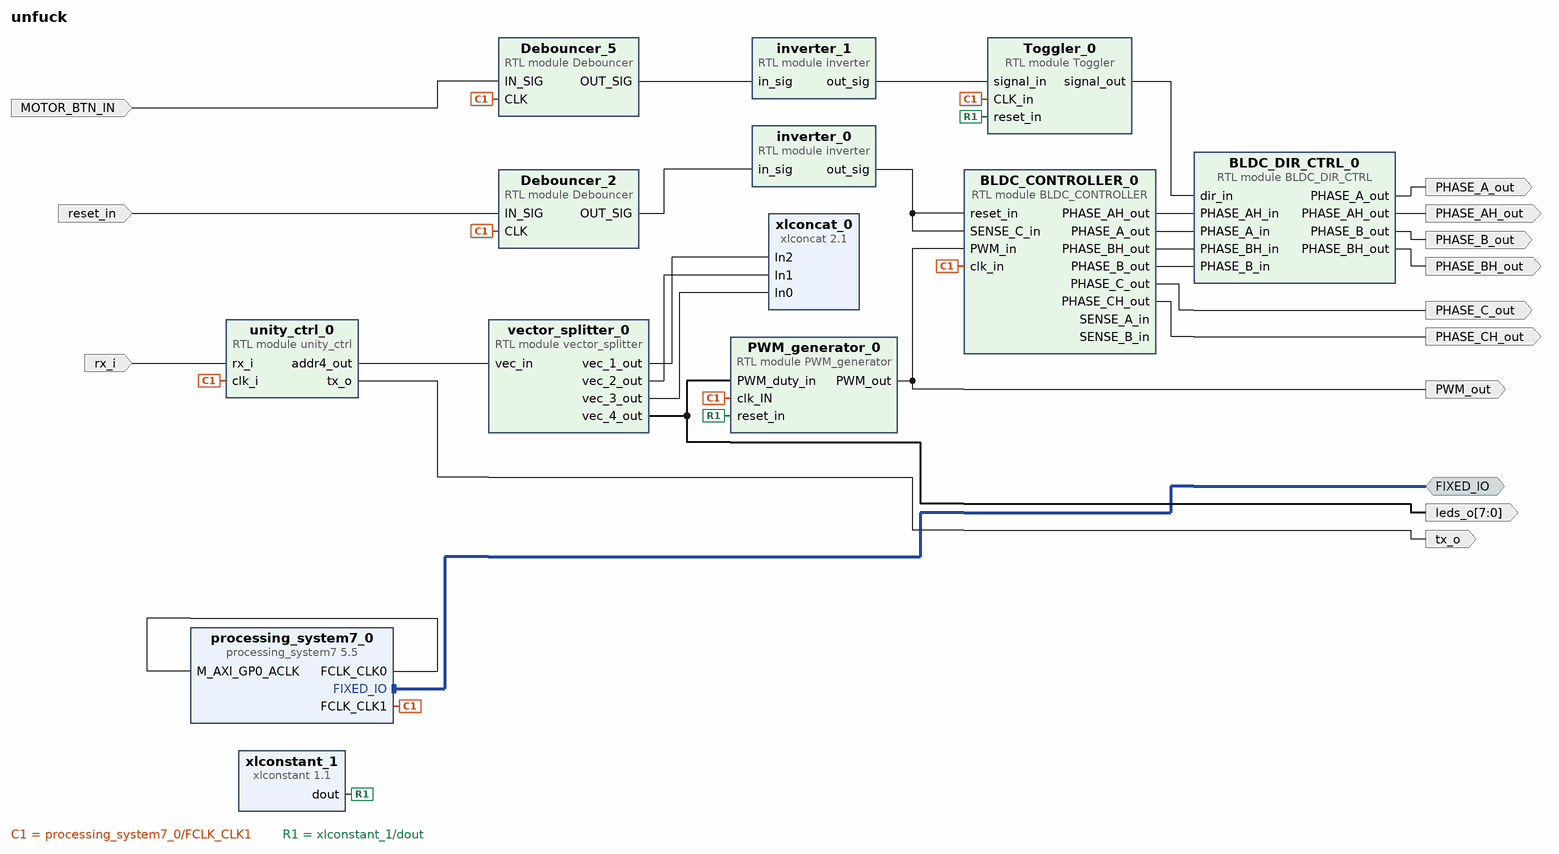
[diagram p0: block diagram of the top level]
# Vivado block design unfuck, xc7z010clg225-1, Vivado 2016.3
create_bd_design unfuck

create_bd_intf_port -mode Master -vlnv xilinx.com:display_processing_system7:fixedio_rtl:1.0 FIXED_IO
create_bd_port -dir O PHASE_CH_out
create_bd_port -dir O PHASE_C_out
create_bd_port -dir O PHASE_AH_out
create_bd_port -dir O PHASE_A_out
create_bd_port -dir O PHASE_BH_out
create_bd_port -dir O PHASE_B_out
create_bd_port -dir I MOTOR_BTN_IN
create_bd_port -dir O PWM_out
create_bd_port -dir I -type rst reset_in
set_property -dict {CONFIG.POLARITY ACTIVE_LOW} [get_bd_ports reset_in]
create_bd_port -dir I rx_i
create_bd_port -dir O -from 7 -to 0 leds_o
create_bd_port -dir O tx_o

create_bd_cell -type module -reference Debouncer Debouncer_2
set_property -dict {CONFIG.THRESHOLD 100000} [get_bd_cells Debouncer_2]
create_bd_cell -type module -reference PWM_generator PWM_generator_0
create_bd_cell -type module -reference Toggler Toggler_0
create_bd_cell -type module -reference inverter inverter_0
create_bd_cell -type ip -vlnv xilinx.com:ip:processing_system7:5.5 processing_system7_0
set_property -dict [list \
  CONFIG.PCW_FCLK_CLK1_BUF TRUE \
  CONFIG.PCW_APU_PERIPHERAL_FREQMHZ 666.666666 \
  CONFIG.PCW_FPGA0_PERIPHERAL_FREQMHZ 50 \
  CONFIG.PCW_FPGA1_PERIPHERAL_FREQMHZ 200 \
  CONFIG.PCW_M_AXI_GP0_FREQMHZ 50 \
  CONFIG.PCW_NUM_F2P_INTR_INPUTS 1 \
  CONFIG.PCW_DQ_WIDTH 16 \
  CONFIG.PCW_DQS_WIDTH 2 \
  CONFIG.PCW_DM_WIDTH 2 \
  CONFIG.PCW_MIO_PRIMITIVE 32 \
  CONFIG.PCW_EN_CLK1_PORT 1 \
  CONFIG.PCW_PERIPHERAL_BOARD_PRESET part0 \
  CONFIG.PCW_PRESET_BANK1_VOLTAGE {LVCMOS 3.3V} \
  CONFIG.PCW_UIPARAM_DDR_ENABLE 0 \
  CONFIG.PCW_QSPI_PERIPHERAL_ENABLE 1 \
  CONFIG.PCW_QSPI_QSPI_IO {MIO 1 .. 6} \
  CONFIG.PCW_QSPI_GRP_SINGLE_SS_ENABLE 1 \
  CONFIG.PCW_QSPI_GRP_SINGLE_SS_IO {MIO 1 .. 6} \
  CONFIG.PCW_ENET0_PERIPHERAL_ENABLE 0 \
  CONFIG.PCW_SD0_PERIPHERAL_ENABLE 0 \
  CONFIG.PCW_UART1_PERIPHERAL_ENABLE 0 \
  CONFIG.PCW_USB0_PERIPHERAL_ENABLE 0 \
  CONFIG.PCW_USB_RESET_ENABLE 1 \
  CONFIG.PCW_I2C_RESET_ENABLE 1 \
  CONFIG.PCW_GPIO_MIO_GPIO_ENABLE 1 \
  CONFIG.PCW_GPIO_MIO_GPIO_IO MIO \
  CONFIG.PCW_APU_CLK_RATIO_ENABLE 0.251400462962963 \
  CONFIG.PCW_ENET0_PERIPHERAL_CLKSRC External \
  CONFIG.PCW_UIPARAM_GENERATE_SUMMARY NONE \
  CONFIG.PCW_FPGA_FCLK1_ENABLE 1 \
] [get_bd_cells processing_system7_0]
# 386 more settings of processing_system7_0 are not shown: defaults, MIO pin electricals, DDR timing, and values the tool derives
create_bd_cell -type ip -vlnv xilinx.com:ip:xlconcat:2.1 xlconcat_0
set_property -dict {CONFIG.NUM_PORTS 3 CONFIG.IN0_WIDTH 8 CONFIG.IN1_WIDTH 8 CONFIG.IN2_WIDTH 8} [get_bd_cells xlconcat_0]
create_bd_cell -type ip -vlnv xilinx.com:ip:xlconstant:1.1 xlconstant_1
set_property -dict {CONFIG.CONST_VAL 0} [get_bd_cells xlconstant_1]
create_bd_cell -type module -reference BLDC_CONTROLLER BLDC_CONTROLLER_0
create_bd_cell -type module -reference BLDC_DIR_CTRL BLDC_DIR_CTRL_0
create_bd_cell -type module -reference unity_ctrl unity_ctrl_0
create_bd_cell -type module -reference vector_splitter vector_splitter_0
create_bd_cell -type module -reference Debouncer Debouncer_5
set_property -dict {CONFIG.THRESHOLD 100000} [get_bd_cells Debouncer_5]
create_bd_cell -type module -reference inverter inverter_1

# ---- connections ----

connect_bd_intf_net [get_bd_intf_ports FIXED_IO] [get_bd_intf_pins processing_system7_0/FIXED_IO]
connect_bd_net [get_bd_pins BLDC_CONTROLLER_0/PHASE_AH_out] [get_bd_pins BLDC_DIR_CTRL_0/PHASE_AH_in]
connect_bd_net [get_bd_pins BLDC_CONTROLLER_0/PHASE_A_out] [get_bd_pins BLDC_DIR_CTRL_0/PHASE_A_in]
connect_bd_net [get_bd_pins BLDC_CONTROLLER_0/PHASE_BH_out] [get_bd_pins BLDC_DIR_CTRL_0/PHASE_BH_in]
connect_bd_net [get_bd_pins BLDC_CONTROLLER_0/PHASE_B_out] [get_bd_pins BLDC_DIR_CTRL_0/PHASE_B_in]
connect_bd_net [get_bd_pins BLDC_CONTROLLER_0/PHASE_CH_out] [get_bd_ports PHASE_CH_out]
connect_bd_net [get_bd_pins BLDC_CONTROLLER_0/PHASE_C_out] [get_bd_ports PHASE_C_out]
connect_bd_net [get_bd_pins BLDC_DIR_CTRL_0/PHASE_AH_out] [get_bd_ports PHASE_AH_out]
# net BLDC_DIR_CTRL_0_PHASE_A_SENSE_out has one end: BLDC_CONTROLLER_0/SENSE_A_in
connect_bd_net [get_bd_pins BLDC_DIR_CTRL_0/PHASE_A_out] [get_bd_ports PHASE_A_out]
connect_bd_net [get_bd_pins BLDC_DIR_CTRL_0/PHASE_BH_out] [get_bd_ports PHASE_BH_out]
connect_bd_net [get_bd_pins BLDC_DIR_CTRL_0/PHASE_B_out] [get_bd_ports PHASE_B_out]
connect_bd_net [get_bd_pins Debouncer_2/OUT_SIG] [get_bd_pins inverter_0/in_sig]
connect_bd_net [get_bd_pins Debouncer_5/OUT_SIG] [get_bd_pins inverter_1/in_sig]
connect_bd_net [get_bd_ports MOTOR_BTN_IN] [get_bd_pins Debouncer_5/IN_SIG]
connect_bd_net [get_bd_pins PWM_generator_0/PWM_out] [get_bd_ports PWM_out] [get_bd_pins BLDC_CONTROLLER_0/PWM_in]
connect_bd_net [get_bd_pins Toggler_0/signal_out] [get_bd_pins BLDC_DIR_CTRL_0/dir_in]
connect_bd_net [get_bd_pins inverter_0/out_sig] [get_bd_pins BLDC_CONTROLLER_0/reset_in] [get_bd_pins BLDC_CONTROLLER_0/SENSE_C_in]
connect_bd_net [get_bd_pins inverter_1/out_sig] [get_bd_pins Toggler_0/signal_in]
connect_bd_net [get_bd_pins processing_system7_0/FCLK_CLK0] [get_bd_pins processing_system7_0/M_AXI_GP0_ACLK]
connect_bd_net [get_bd_pins processing_system7_0/FCLK_CLK1] \
  [get_bd_pins Debouncer_2/CLK] [get_bd_pins PWM_generator_0/clk_IN] [get_bd_pins Toggler_0/CLK_in] \
  [get_bd_pins BLDC_CONTROLLER_0/clk_in] [get_bd_pins unity_ctrl_0/clk_i] [get_bd_pins Debouncer_5/CLK]
connect_bd_net [get_bd_ports reset_in] [get_bd_pins Debouncer_2/IN_SIG]
connect_bd_net [get_bd_ports rx_i] [get_bd_pins unity_ctrl_0/rx_i]
connect_bd_net -net unity_ctrl_0_leds_o [get_bd_pins vector_splitter_0/vec_4_out] [get_bd_ports leds_o] [get_bd_pins PWM_generator_0/PWM_duty_in]
connect_bd_net -net unity_ctrl_0_out_addr4 [get_bd_pins unity_ctrl_0/addr4_out] [get_bd_pins vector_splitter_0/vec_in]
connect_bd_net [get_bd_pins unity_ctrl_0/tx_o] [get_bd_ports tx_o]
connect_bd_net [get_bd_pins vector_splitter_0/vec_1_out] [get_bd_pins xlconcat_0/In2]
connect_bd_net [get_bd_pins vector_splitter_0/vec_2_out] [get_bd_pins xlconcat_0/In1]
connect_bd_net [get_bd_pins vector_splitter_0/vec_3_out] [get_bd_pins xlconcat_0/In0]
connect_bd_net [get_bd_pins xlconstant_1/dout] [get_bd_pins PWM_generator_0/reset_in] [get_bd_pins Toggler_0/reset_in]
# net BLDC_DIR_CTRL_0_PHASE_B_SENSE_out has one end: BLDC_CONTROLLER_0/SENSE_B_in

validate_bd_design
save_bd_design
